# Altium schematic sheet CONNECTOR.SchDoc
size 420 x 297 mm; SheetNumber: 2; SheetTotal: 4
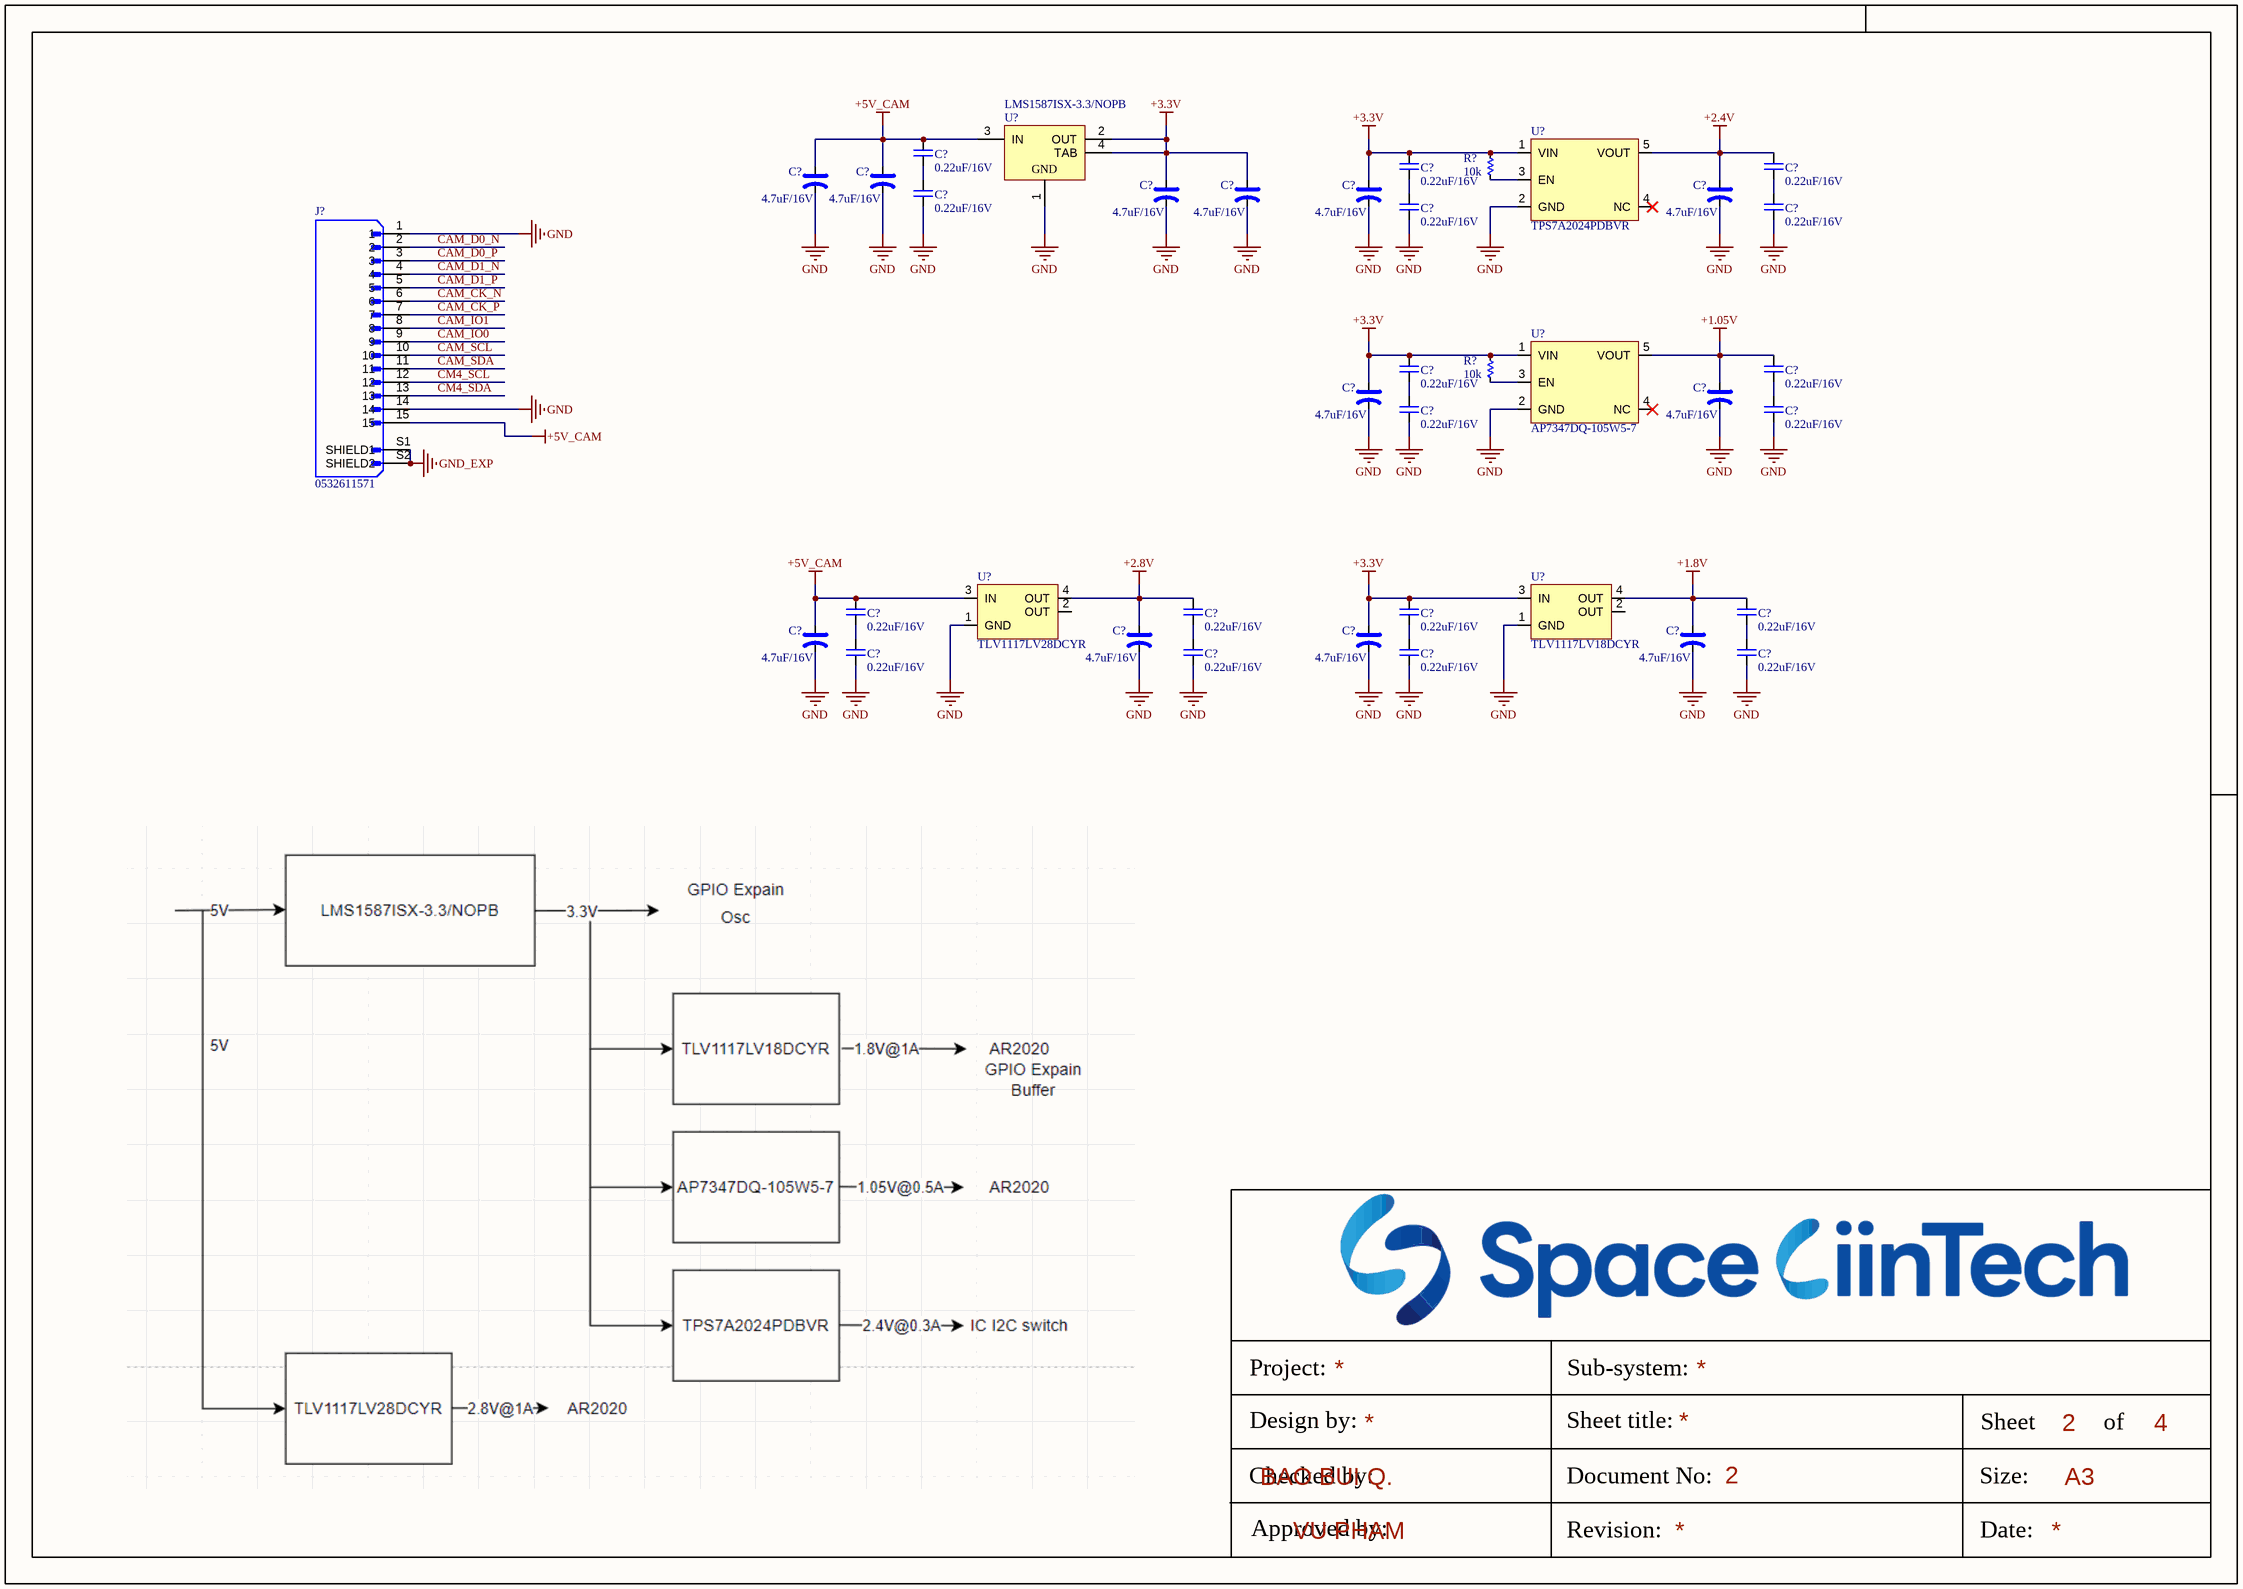
[diagram p0: CONNECTOR.SchDoc]

## Parts
(Parts that share a designator on the sheet are numbered #1, #2 ... from top to bottom, then left to right.)
C?#1  0.22uF/16V
C?#2  0.22uF/16V
C?#3  0.22uF/16V
C?#4  4.7uF/16V
C?#5  4.7uF/16V
C?#6  0.22uF/16V
C?#7  4.7uF/16V
C?#8  4.7uF/16V
C?#9  4.7uF/16V
C?#10  4.7uF/16V
C?#11  0.22uF/16V
C?#12  0.22uF/16V
C?#13  0.22uF/16V
C?#14  0.22uF/16V
C?#15  4.7uF/16V
C?#16  4.7uF/16V
C?#17  0.22uF/16V
C?#18  0.22uF/16V
C?#19  0.22uF/16V
C?#20  0.22uF/16V
C?#21  0.22uF/16V
C?#22  0.22uF/16V
C?#23  4.7uF/16V
C?#24  4.7uF/16V
C?#25  4.7uF/16V
C?#26  4.7uF/16V
C?#27  0.22uF/16V
C?#28  0.22uF/16V
C?#29  0.22uF/16V
C?#30  0.22uF/16V
J?  0532611571  [0532611571]
R?#1  10k
R?#2  10k
U?#1  LMS1587ISX-3.3/NOPB  [TS3B_L]
U?#2  TPS7A2024PDBVR
U?#3  AP7347DQ-105W5-7
U?#4  TLV1117LV28DCYR
U?#5  TLV1117LV18DCYR

## Nets
+1.05V: C?#14.2 C?#16.1 U?#3.5(VOUT)
+1.8V: C?#22.2 C?#26.1 U?#5.4(OUT)
+2.4V: C?#3.2 C?#10.1 U?#2.5(VOUT)
+2.8V: C?#20.2 C?#24.1 U?#4.4(OUT)
+3.3V: C?#2.2 C?#7.1 C?#8.1 C?#9.1 C?#13.2 C?#15.1 C?#21.2 C?#25.1 R?#1.2 R?#2.2 U?#1.2(OUT) U?#1.4(TAB) U?#2.1(VIN) U?#3.1(VIN) U?#5.3(IN)
+5V_CAM: C?#1.2 C?#4.1 C?#5.1 C?#19.2 C?#23.1 J?.15 U?#1.3(IN) U?#4.3(IN)
GND: C?#4.2 C?#5.2 C?#6.1 C?#7.2 C?#8.2 C?#9.2 C?#10.2 C?#11.1 C?#12.1 C?#15.2 C?#16.2 C?#17.1 C?#18.1 C?#23.2 C?#24.2 C?#25.2 C?#26.2 C?#27.1 C?#28.1 C?#29.1 C?#30.1 J?.1 J?.14 U?#1.1(GND) U?#2.2(GND) U?#3.2(GND) U?#4.1(GND) U?#5.1(GND)
GND_EXP: J?.S1(SHIELD1) J?.S2(SHIELD2)
CAM_CK_N: J?.6
CAM_CK_P: J?.7
CAM_D0_N: J?.2
CAM_D0_P: J?.3
CAM_D1_N: J?.4
CAM_D1_P: J?.5
CAM_IO0: J?.9
CAM_IO1: J?.8
CAM_SCL: J?.10
CAM_SDA: J?.11
CM4_SCL: J?.12
CM4_SDA: J?.13
NetC?#1_1: C?#1.1 C?#6.2
NetC?#2_1: C?#2.1 C?#11.2
NetC?#3_1: C?#3.1 C?#12.2
NetC?#13_1: C?#13.1 C?#17.2
NetC?#14_1: C?#14.1 C?#18.2
NetC?#19_1: C?#19.1 C?#27.2
NetC?#20_1: C?#20.1 C?#28.2
NetC?#21_1: C?#21.1 C?#29.2
NetC?#22_1: C?#22.1 C?#30.2
NetR?#1_1: R?#1.1 U?#2.3(EN)
NetR?#2_1: R?#2.1 U?#3.3(EN)

Not connected (* = marked no-connect by the designer): U?#2 4(NC)*; U?#3 4(NC)*; U?#4 2(OUT); U?#5 2(OUT)

## Notes on the sheet
- Project:
- Sub-system:
- Design by:
- BAO BUI Q.
- Sheet title:
- Sheet
- A3
- of
- Checked by:
- Approved by:
- VU PHAM
- Revision:
- Document No:
- Size:
- Date:

## Library data of the parts
C?#1-C?#3 C?#6 C?#11-C?#14 C?#17-C?#22 C?#27-C?#30 = CAP_SMD: CAP_Chip; Value: 33pF
C?#4 C?#5 C?#7-C?#10 C?#15 C?#16 C?#23-C?#26 = CAP_TH: CAP_Polarization; Published: 8-Jun-2000; LatestRevisionDate: 17-Jul-2002; LatestRevisionNote: Re-released for DXP Platform.; PackageReference: POLAR0.8; Publisher: Altium Limited
J? = CONN_SMD_15: Conn Shrouded Header (4 Sides) HDR 15 POS 1.25mm Solder RA Side Entry SMD PicoBladeâ„¢ T/R; MF: Molex; Package: None; MP: 532611571; Check_prices: https://www.snapeda.com/parts/532611571/Molex/view-part/?ref=eda; Purchase-URL: https://pricing.snapeda.com/search/part/532611571/?ref=eda; Value: *; Availability: In Stock; Price: None; SnapEDA_Link: https://www.snapeda.com/parts/532611571/Molex/view-part/?ref=snap
R?#1 R?#2 = RES-SMD: RES-Chip; Manufacturer: Generic Components; Class: Passive; Published: 08/06/2000; Publisher: Altium Hobart Technology Centre
U?#1 = CMP-0062-00180-3: 3A Low Dropout Fast Response Regulators, 3-pin TO-263, Pb-Free; Manufacturer: National Semiconductor; PowerWise: N; High-Reliability: Y; PackageTopMarking: NSUZXYTTE#*LMS1587*IS-3.3; CompType: LDO IC; ComponentLink1Description: Manufacturer URL; PackageReference: TS3B; ComponentLink1URL: http://www.national.com/; ComponentLink2URL: http://www.national.com/ds/LM/LMS1587.pdf; DatasheetVersion: Jun-2005; ComponentLink3URL: http://www.national.com/pf/LM/LMS1587.html; PartNumber: LMS1587ISX-3.3/NOPB; RevisionNote: SCH symbol layout adjusted; PinCount: 3; RoHS: Y; Code_JEDEC: MO-169-AA; PackageDescription: TO-263, Molded, .400 x .390 x .180in, 3 Lead, .1in Pitch, Surface Mount; ComponentLink4Description: TS3B Package Page; ComponentLink3Description: LMS1587 Web Page; PackageVersion: revF, Apr-2005; ComponentLink2Description: LMS1587 Datasheet; ComponentLink4URL: http://www.national.com/packaging/folders/ts3b.html
U?#2 U?#3 = IC_POWER_AP7347DQ
U?#4 U?#5 = IC_POWER_TLV1117LV